# EAGLE schematic ComputeModule (EAGLE 9.4.2)
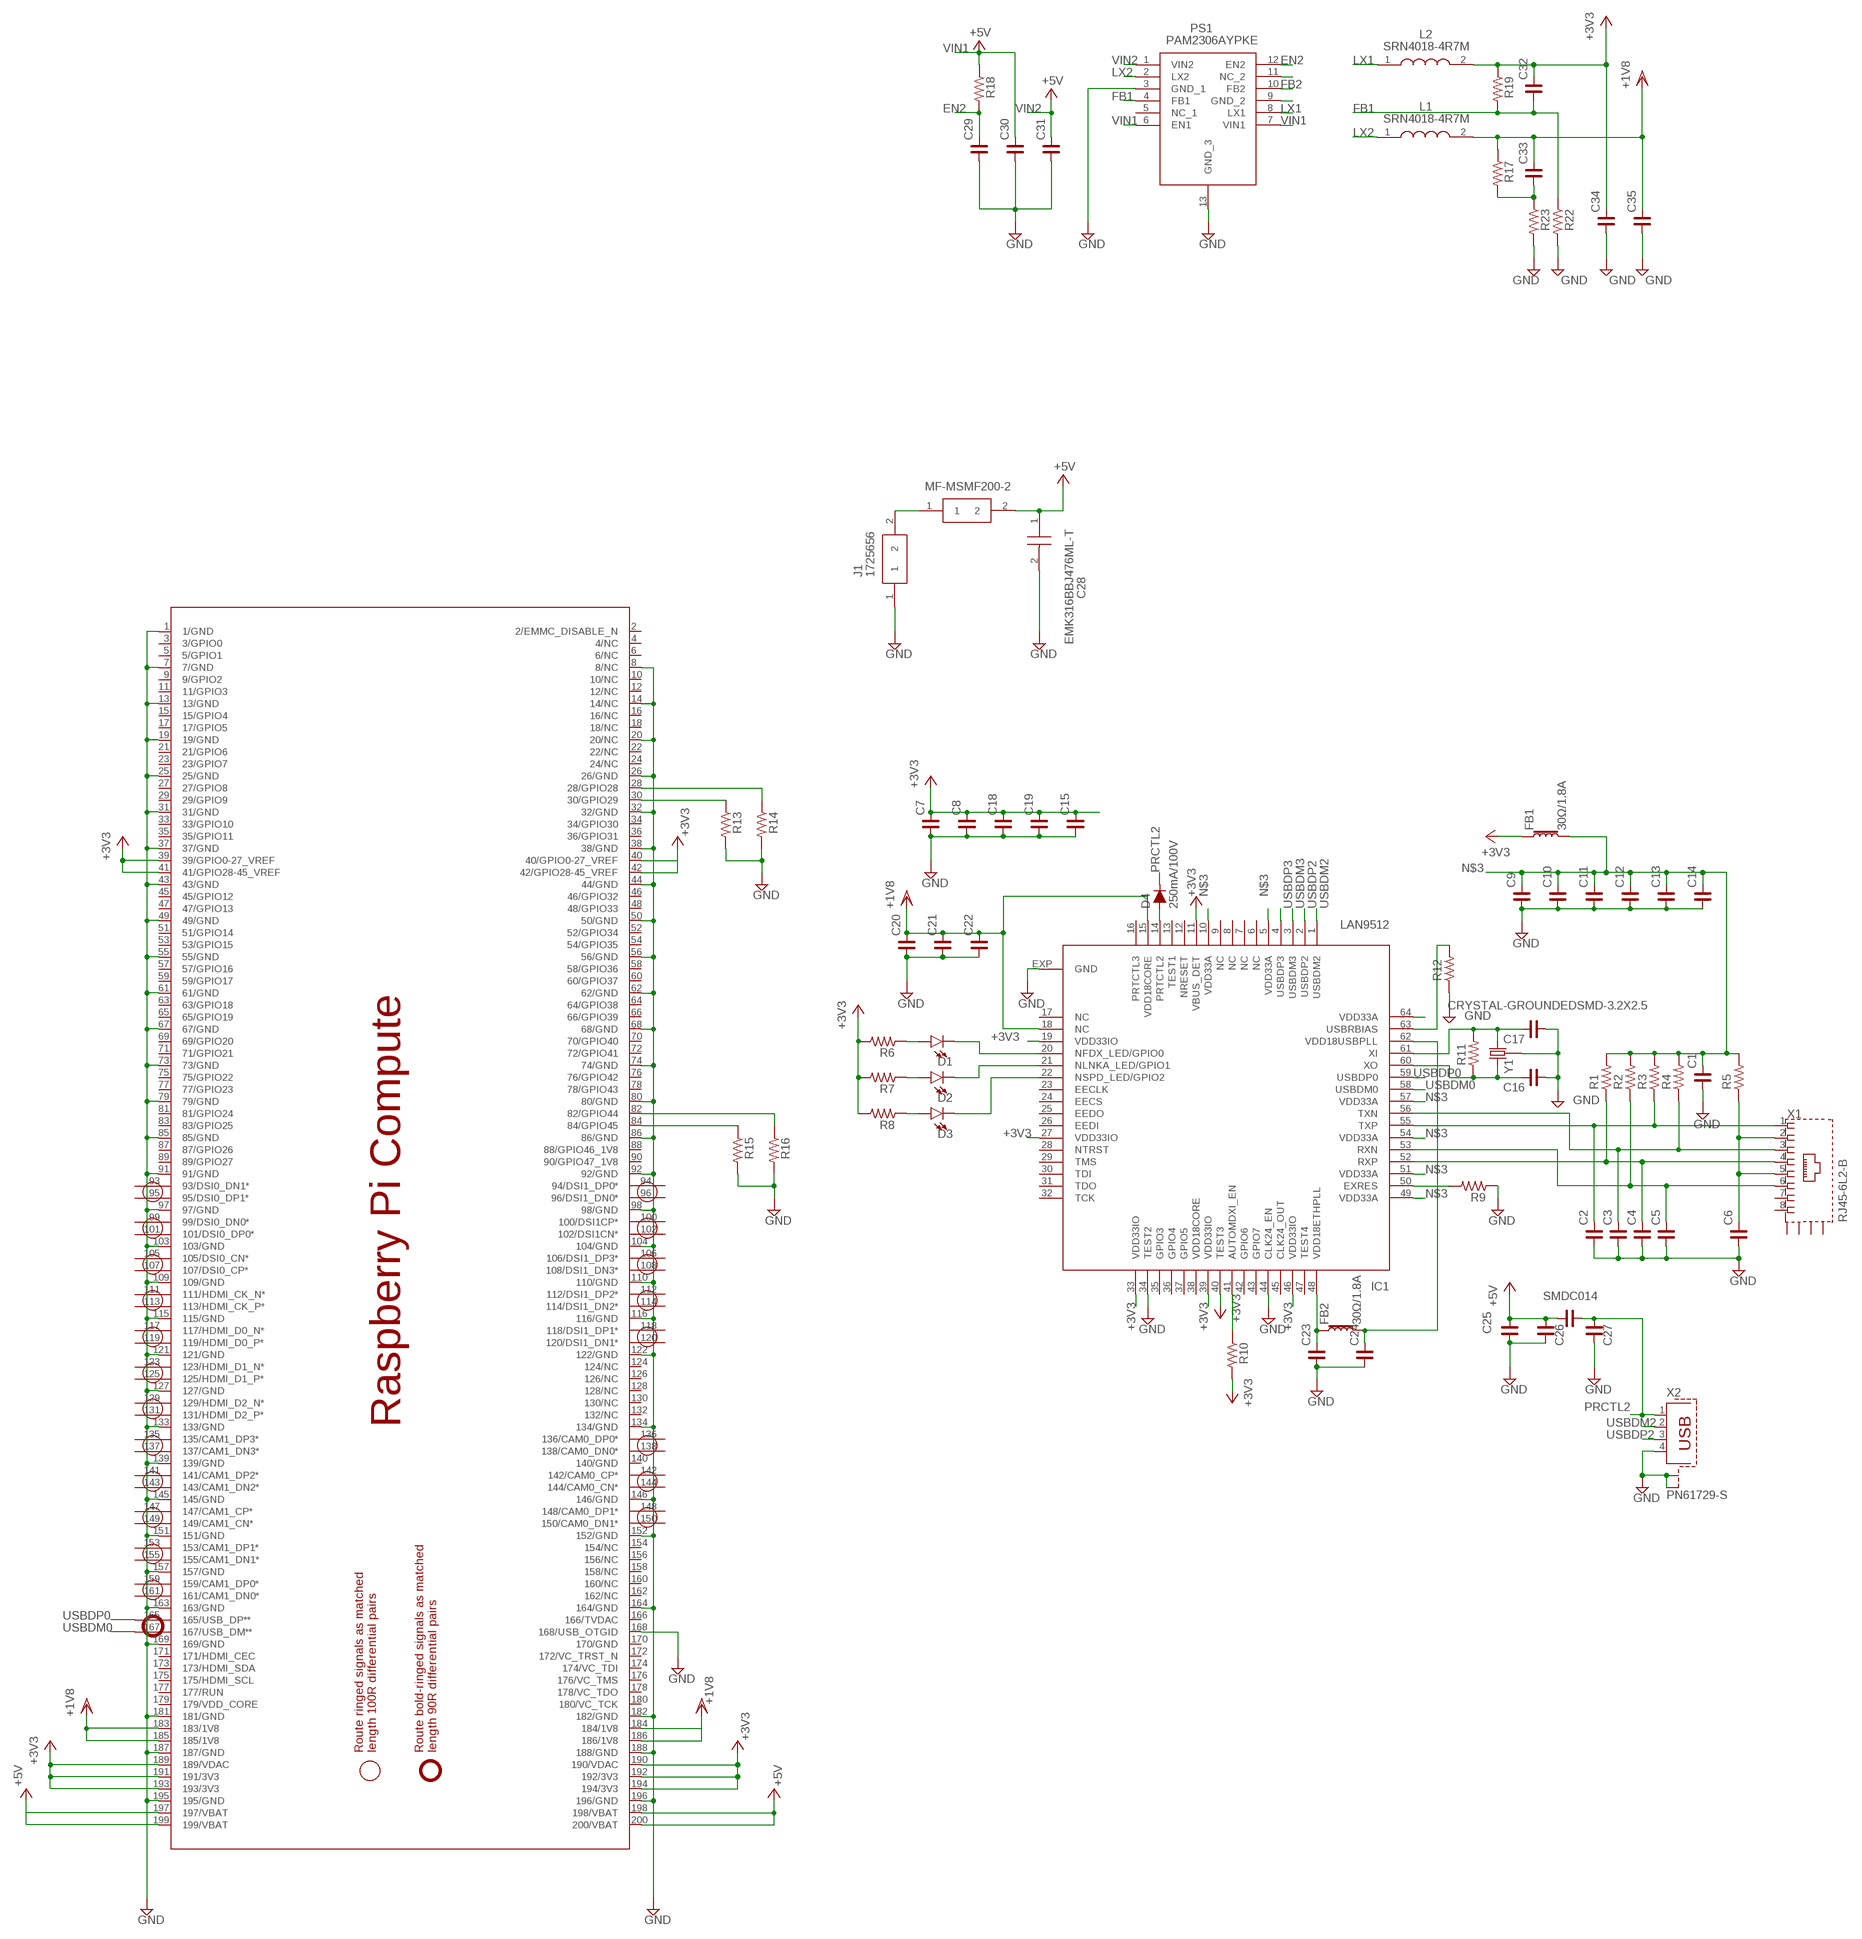
[diagram p0: schematic, sheet 1]

## Parts
C1  C_0603  [C0603]
C2  C_0603  [C0603]
C3  C_0603  [C0603]
C4  C_0603  [C0603]
C5  C_0603  [C0603]
C6  C_0603  [C0603]
C7  C_0603  [C0603]
C8  C_0603  [C0603]
C9  C_0603  [C0603]
C10  C_0603  [C0603]
C11  C_0603  [C0603]
C12  C_0603  [C0603]
C13  C_0603  [C0603]
C14  C_0603  [C0603]
C15  C_0603  [C0603]
C16  C_0603  [C0603]
C17  C_0603  [C0603]
C18  C_0603  [C0603]
C19  C_0603  [C0603]
C20  C_0603  [C0603]
C21  C_0603  [C0603]
C22  C_0603  [C0603]
C23  C_0603  [C0603]
C24  C_0603  [C0603]
C25  C_0603  [C0603]
C26  C_0603  [C0603]
C27  C_0603  [C0603]
C28  EMK316BBJ476ML-T  [CAPC3216X180N]
C29  C_0603  [C0603]
C30  C_0603  [C0603]
C31  C_0603  [C0603]
C32  C_0603  [C0603]
C33  C_0603  [C0603]
C34  C_0603  [C0603]
C35  C_0603  [C0603]
D1  LED-FKIT-1206  [FKIT-LED-1206]
D2  LED-FKIT-1206  [FKIT-LED-1206]
D3  LED-FKIT-1206  [FKIT-LED-1206]
D4  250mA/100V  DIODE-BAS16J  [SOD-323]
F1  MF-MSMF200-2  [FUSC4632X85N]
FB1  30Ω/1.8A  FERRITE_BEAD-0603  [0603]
FB2  30Ω/1.8A  FERRITE_BEAD-0603  [0603]
IC1  LAN9512  [QFN64-9X9]
J1  1725656  [1725656]
L1  SRN4018-4R7M  [SRN4018]
L2  SRN4018-4R7M  [SRN4018]
PCB1  RPI_COMPUTE  [RPI_COMPUTE]
PS1  PAM2306AYPKE  [SON45P300X300X80-13N]
R1  R_0603  [R0603]
R2  R_0603  [R0603]
R3  R_0603  [R0603]
R4  R_0603  [R0603]
R5  R_0603  [R0603]
R6  R_0603  [R0603]
R7  R_0603  [R0603]
R8  R_0603  [R0603]
R9  R_0603  [R0603]
R10  R_0603  [R0603]
R11  R_0603  [R0603]
R12  R_0603  [R0603]
R13  R_0603  [R0603]
R14  R_0603  [R0603]
R15  R_0603  [R0603]
R16  R_0603  [R0603]
R17  R_0603  [R0603]
R18  R_0603  [R0603]
R19  R_0603  [R0603]
R22  R_0603  [R0603]
R23  R_0603  [R0603]
SMDC014  C_1812  [C1812]
X1  RJ45-6L2-B  [RJ45-SHIELD2]
X2  PN61729-S  [PN61729-S]
Y1  CRYSTAL-GROUNDEDSMD-3.2X2.5  [CRYSTAL-SMD-3.2X2.5MM]

## Nets
+3V3: C7.2 C8.2 C15.2 C18.2 C19.2 C32.2 C34.2 FB1.1 IC1.11(VBUS_DET) IC1.19(VDD33IO) IC1.27(VDD33IO) IC1.33(VDD33IO) IC1.39(VDD33IO) IC1.40(TEST3) IC1.46(VDD33IO) L2.2 PCB1.39(39/GPIO0-27_VREF) PCB1.41(41/GPIO28-45_VREF) PCB1.42(42/GPIO28-45_VREF) PCB1.189(189/VDAC) PCB1.190(190/VDAC) PCB1.191(191/3V3) PCB1.192(192/3V3) PCB1.193(193/3V3) PCB1.194(194/3V3) R6.2 R7.2 R8.2 R10.2 R19.1
+5V: C25.2 C26.2 C28.1 F1.2 PCB1.198(198/VBAT) PCB1.199(199/VBAT) PCB1.200(200/VBAT) SMDC014.1
EN2: C29.2 PS1.12(EN2) R18.2
FB1: C32.1 PS1.4(FB1) R19.2 R22.1
FB2: PS1.10(FB2)
GND: C1.1 C2.1 C3.1 C4.1 C5.1 C6.1 C7.1 C8.1 C9.1 C10.1 C11.1 C12.1 C13.1 C14.1 C15.1 C16.1 C17.1 C18.1 C19.1 C20.1 C21.1 C22.1 C23.1 C24.1 C25.1 C26.1 C27.1 C28.2 C34.1 C35.1 IC1.34(TEST2) IC1.44(CLK24_EN) IC1.EXP(GND) J1.1 PCB1.1(1/GND) PCB1.7(7/GND) PCB1.8(8/NC) PCB1.13(13/GND) PCB1.14(14/NC) PCB1.19(19/GND) PCB1.20(20/NC) PCB1.25(25/GND) PCB1.26(26/GND) PCB1.31(31/GND) PCB1.32(32/GND) PCB1.37(37/GND) PCB1.38(38/GND) PCB1.43(43/GND) PCB1.44(44/GND) PCB1.49(49/GND) PCB1.50(50/GND) PCB1.55(55/GND) PCB1.56(56/GND) PCB1.61(61/GND) PCB1.62(62/GND) PCB1.67(67/GND) PCB1.68(68/GND) PCB1.73(73/GND) PCB1.74(74/GND) PCB1.79(79/GND) PCB1.80(80/GND) PCB1.85(85/GND) PCB1.86(86/GND) PCB1.91(91/GND) PCB1.92(92/GND) PCB1.97(97/GND) PCB1.98(98/GND) PCB1.103(103/GND) PCB1.104(104/GND) PCB1.109(109/GND) PCB1.110(110/GND) PCB1.115(115/GND) PCB1.116(116/GND) PCB1.121(121/GND) PCB1.122(122/GND) PCB1.127(127/GND) PCB1.133(133/GND) PCB1.134(134/GND) PCB1.139(139/GND) PCB1.145(145/GND) PCB1.146(146/GND) PCB1.151(151/GND) PCB1.152(152/GND) PCB1.157(157/GND) PCB1.163(163/GND) PCB1.164(164/GND) PCB1.168(168/USB_OTGID) PCB1.169(169/GND) PCB1.181(181/GND) PCB1.182(182/GND) PCB1.187(187/GND) PCB1.188(188/GND) PCB1.195(195/GND) PCB1.196(196/GND) PS1.3(GND_1) PS1.13(GND_3) R9.1 R12.1 R13.2 R14.2 R15.2 R16.2 R22.2 R23.2 X2.4 X2.S1 X2.S2 Y1.2 Y1.4
LX1: L2.1 PS1.8(LX1)
LX2: L1.1 PS1.2(LX2)
N$1: C6.2 R5.1 X1.2 X1.5
N$2: C2.2 IC1.55(TXP) R3.1 X1.1
N$3: C1.2 C9.2 C10.2 C11.2 C12.2 C13.2 C14.2 FB1.2 IC1.5(VDD33A) IC1.10(VDD33A) IC1.49(VDD33A) IC1.51(VDD33A) IC1.54(VDD33A) IC1.57(VDD33A) R1.2 R2.2 R3.2 R4.2 R5.2
N$4: C3.2 IC1.56(TXN) R4.1 X1.3
N$5: C4.2 IC1.52(RXP) R1.1 X1.4
N$6: C5.2 IC1.53(RXN) R2.1 X1.6
N$7: D1.C IC1.20(NFDX_LED/GPIO0)
N$8: D2.C IC1.21(NLNKA_LED/GPIO1)
N$9: D3.C IC1.22(NSPD_LED/GPIO2)
N$10: D1.A R6.1
N$11: IC1.64(VDD33A)
N$12: D2.A R7.1
N$13: D3.A R8.1
N$14: IC1.50(EXRES) R9.2
N$15: C16.2 IC1.60(XO) R11.1 Y1.1
N$16: IC1.41(AUTOMDXI_EN) R10.1
N$17: C17.2 IC1.61(XI) R11.2 Y1.3
N$18: C23.2 FB2.1 IC1.48(VDD18ETHPLL)
N$19: C24.2 FB2.2 IC1.62(VDD18USBPLL)
N$20: F1.1 J1.2
N$21: IC1.63(USBRBIAS) R12.2
N$22: D4.A IC1.14(PRTCTL2)
N$23: PCB1.28(28/GPIO28) R14.1
N$24: PCB1.30(30/GPIO29) R13.1
N$25: PCB1.40(40/GPIO0-27_VREF)
N$26: PCB1.82(82/GPIO44) R16.1
N$27: PCB1.84(84/GPIO45) R15.1
N$28: PCB1.184(184/1V8)
N$31: PS1.11(NC_2)
N$32: PCB1.197(197/VBAT)
N$33: C29.1 C30.1 C31.1 ; supply symbol labelled GND
N$34: PS1.9(GND_2)
N$35: C33.1 R17.2 R23.1
PRCTL2: C27.2 D4.C SMDC014.2 X2.1
USBDM0: IC1.58(USBDM0) PCB1.167(167/USB_DM**)
USBDM2: IC1.1(USBDM2) X2.2
USBDM3: IC1.3(USBDM3)
USBDP0: IC1.59(USBDP0) PCB1.165(165/USB_DP**)
USBDP2: IC1.2(USBDP2) X2.3
USBDP3: IC1.4(USBDP3)
VDD: C20.2 C21.2 C22.2 C33.2 C35.2 IC1.15(VDD18CORE) IC1.18(NC) L1.2 PCB1.183(183/1V8) PCB1.185(185/1V8) PCB1.186(186/1V8) R17.1 ; supply symbol labelled +1V8
VIN1: C30.2 PS1.6(EN1) PS1.7(VIN1) R18.1 ; supply symbol labelled +5V
VIN2: C31.2 PS1.1(VIN2) ; supply symbol labelled +5V
Unconnected: IC1.6(NC) IC1.7(NC) IC1.8(NC) IC1.9(NC) IC1.12(NRESET) IC1.13(TEST1) IC1.16(PRTCTL3) IC1.17(NC) IC1.23(EECLK) IC1.24(EECS) IC1.25(EEDO) IC1.26(EEDI) IC1.28(NTRST) IC1.29(TMS) IC1.30(TDI) IC1.31(TDO) IC1.32(TCK) IC1.35(GPIO3) IC1.36(GPIO4) IC1.37(GPIO5) IC1.38(VDD18CORE) IC1.42(GPIO6) IC1.43(GPIO7) IC1.45(CLK24_OUT) IC1.47(TEST4) PCB1.2(2/EMMC_DISABLE_N) PCB1.3(3/GPIO0) PCB1.4(4/NC) PCB1.5(5/GPIO1) PCB1.6(6/NC) PCB1.9(9/GPIO2) PCB1.10(10/NC) PCB1.11(11/GPIO3) PCB1.12(12/NC) PCB1.15(15/GPIO4) PCB1.16(16/NC) PCB1.17(17/GPIO5) PCB1.18(18/NC) PCB1.21(21/GPIO6) PCB1.22(22/NC) PCB1.23(23/GPIO7) PCB1.24(24/NC) PCB1.27(27/GPIO8) PCB1.29(29/GPIO9) PCB1.33(33/GPIO10) PCB1.34(34/GPIO30) PCB1.35(35/GPIO11) PCB1.36(36/GPIO31) PCB1.45(45/GPIO12) PCB1.46(46/GPIO32) PCB1.47(47/GPIO13) PCB1.48(48/GPIO33) PCB1.51(51/GPIO14) PCB1.52(52/GPIO34) PCB1.53(53/GPIO15) PCB1.54(54/GPIO35) PCB1.57(57/GPIO16) PCB1.58(58/GPIO36) PCB1.59(59/GPIO17) PCB1.60(60/GPIO37) PCB1.63(63/GPIO18) PCB1.64(64/GPIO38) PCB1.65(65/GPIO19) PCB1.66(66/GPIO39) PCB1.69(69/GPIO20) PCB1.70(70/GPIO40) PCB1.71(71/GPIO21) PCB1.72(72/GPIO41) PCB1.75(75/GPIO22) PCB1.76(76/GPIO42) PCB1.77(77/GPIO23) PCB1.78(78/GPIO43) PCB1.81(81/GPIO24) PCB1.83(83/GPIO25) PCB1.87(87/GPIO26) PCB1.88(88/GPIO46_1V8) PCB1.89(89/GPIO27) PCB1.90(90/GPIO47_1V8) PCB1.93(93/DSI0_DN1*) PCB1.94(94/DSI1_DP0*) PCB1.95(95/DSI0_DP1*) PCB1.96(96/DSI1_DN0*) PCB1.99(99/DSI0_DN0*) PCB1.100(100/DSI1CP*) PCB1.101(101/DSI0_DP0*) PCB1.102(102/DSI1CN*) PCB1.105(105/DSI0_CN*) PCB1.106(106/DSI1_DP3*) PCB1.107(107/DSI0_CP*) PCB1.108(108/DSI1_DN3*) PCB1.111(111/HDMI_CK_N*) PCB1.112(112/DSI1_DP2*) PCB1.113(113/HDMI_CK_P*) PCB1.114(114/DSI1_DN2*) PCB1.117(117/HDMI_D0_N*) PCB1.118(118/DSI1_DP1*) PCB1.119(119/HDMI_D0_P*) PCB1.120(120/DSI1_DN1*) PCB1.123(123/HDMI_D1_N*) PCB1.124(124/NC) PCB1.125(125/HDMI_D1_P*) PCB1.126(126/NC) PCB1.128(128/NC) PCB1.129(129/HDMI_D2_N*) PCB1.130(130/NC) PCB1.131(131/HDMI_D2_P*) PCB1.132(132/NC) PCB1.135(135/CAM1_DP3*) PCB1.136(136/CAM0_DP0*) PCB1.137(137/CAM1_DN3*) PCB1.138(138/CAM0_DN0*) PCB1.140(140/GND) PCB1.141(141/CAM1_DP2*) PCB1.142(142/CAM0_CP*) PCB1.143(143/CAM1_DN2*) PCB1.144(144/CAM0_CN*) PCB1.147(147/CAM1_CP*) PCB1.148(148/CAM0_DP1*) PCB1.149(149/CAM1_CN*) PCB1.150(150/CAM0_DN1*) PCB1.153(153/CAM1_DP1*) PCB1.154(154/NC) PCB1.155(155/CAM1_DN1*) PCB1.156(156/NC) PCB1.158(158/NC) PCB1.159(159/CAM1_DP0*) PCB1.160(160/NC) PCB1.161(161/CAM1_DN0*) PCB1.162(162/NC) PCB1.166(166/TVDAC) PCB1.170(170/GND) PCB1.171(171/HDMI_CEC) PCB1.172(172/VC_TRST_N) PCB1.173(173/HDMI_SDA) PCB1.174(174/VC_TDI) PCB1.175(175/HDMI_SCL) PCB1.176(176/VC_TMS) PCB1.177(177/RUN) PCB1.178(178/VC_TDO) PCB1.179(179/VDD_CORE) PCB1.180(180/VC_TCK) PS1.5(NC_1) X1.7 X1.8 X1.S1(S) X1.S2(S) X1.S3(S) X1.S4(S)

## Library data of the parts
C1-C27 C29-C35 SMDC014 = rc-master-smd:C_: NON-POLARIZED CAP
C28 = SamacSys_Parts:EMK316BBJ476ML-T: Taiyo Yuden EMK316BBJ476ML-T 47F MLCC 16V dc +/-20% Tolerance SMD Source: Datasheet <https://componentsearchengine.com/Datasheets/1/EMK316BBJ476ML-T.pdf>; DESCRIPTION: Taiyo Yuden EMK316BBJ476ML-T 47F MLCC 16V dc +/-20% Tolerance SMD; HEIGHT: 1.8mm; MANUFACTURER_NAME: TAIYO YUDEN; MANUFACTURER_PART_NUMBER: EMK316BBJ476ML-T; MOUSER_PART_NUMBER: 963-EMK316BBJ476ML-T; MOUSER_PRICE-STOCK: https://www.mouser.com/Search/Refine.aspx?Keyword=963-EMK316BBJ476ML-T
D1-D3 = SparkFun-LED:LED: LED (Generic) Standard schematic elements and footprints for 5mm, 3mm, 1206, and 0603 sized LEDs. Generic LEDs with no color specified.
D4 = SparkFun-DiscreteSemi:DIODE: Diode These are standard reverse protection diodes and small signal diodes. SparkFun Products: SparkFun SparkPunk Sound Kit <https://www.sparkfun.com/products/11177> SparkFun ESP8266 Thing <https://www.sparkfun.com/products/13231>; PROD_ID: DIO-09646
F1 = SamacSys_Parts:MF-MSMF200-2: Fuse, PTC, Resettable, SMD, 1812, 2.0A Bourns 2A Surface Mount Resettable Fuse, 8 V Source: Datasheet <https://componentsearchengine.com/Datasheets/1/MF-MSMF200-2.pdf>; DESCRIPTION: Fuse, PTC, Resettable, SMD, 1812, 2.0A Bourns 2A Surface Mount Resettable Fuse, 8 V; HEIGHT: 0.85mm; MANUFACTURER_NAME: Bourns; MANUFACTURER_PART_NUMBER: MF-MSMF200-2; MOUSER_PART_NUMBER: 652-MF-MSMF200-2; MOUSER_PRICE-STOCK: https://www.mouser.com/Search/Refine.aspx?Keyword=652-MF-MSMF200-2
FB1 FB2 = SparkFun-Coils:FERRITE_BEAD: Ferrite Bead (blocks, cores, rings, chokes, etc.) Inductor with layers of ferrite used to suppress high frequencies. Often used to isolate high frequency noise. SparkFun Products: IOIO-OTG - V2.2 <https://www.sparkfun.com/products/13613> SparkFun SAMD21 Mini Breakout <https://www.sparkfun.com/products/13664> SparkFun 6 Degrees of Freedom Breakout - LSM6DS3 <https://www.sparkfun.com/products/13339> SparkFun SAMD21 Dev Breakout <https://www.sparkfun.com/products/13672>; PROD_ID: NDUC-07859
IC1 = raspberrypi_cm:LAN9512: LAN9512 www.hasseb.fi
J1 = SamacSys_Parts:1725656: 2 way PCB vertical mount terminal,2.54mm 2 way PCB vertical mount terminal,2.54mm Source: Datasheet <https://componentsearchengine.com/Datasheets/1/1725656.pdf>; DESCRIPTION: 2 way PCB vertical mount terminal,2.54mm 2 way PCB vertical mount terminal,2.54mm; HEIGHT: 8mm; MANUFACTURER_NAME: Phoenix Contact; MANUFACTURER_PART_NUMBER: 1725656; MOUSER_PART_NUMBER: 651-1725656; MOUSER_PRICE-STOCK: https://www.mouser.com/Search/Refine.aspx?Keyword=651-1725656
L1 L2 = SamacSys_Parts:SRN4018-4R7M: Inductor SMD 4x4 semi-shielded 4,7uH Bourns SRN4018 Series Shielded Wire-wound SMD Inductor with a Ferrite Core, 4.7 uH +/-20% Wire-Wound 1.9A rms Idc Source: Datasheet <https://componentsearchengine.com/Datasheets/1/SRN4018-4R7M.pdf>; DESCRIPTION: Inductor SMD 4x4 semi-shielded 4,7uH Bourns SRN4018 Series Shielded Wire-wound SMD Inductor with a Ferrite Core, 4.7 uH +/-20% Wire-Wound 1.9A rms Idc; HEIGHT: mm; MANUFACTURER_NAME: Bourns; MANUFACTURER_PART_NUMBER: SRN4018-4R7M; MOUSER_PART_NUMBER: 652-SRN4018-4R7M; MOUSER_PRICE-STOCK: https://www.mouser.com/Search/Refine.aspx?Keyword=652-SRN4018-4R7M
PCB1 = e14_Rpi_Compute_RevC:RPI_COMPUTE: Device for a Raspberry PI Compute module. Note that the package is for a DDR2 connector of 'standard' orientation. Example: TE Connectivity P/N: 1565917-4, Newark P/N: 08P0616, Farnell P/N: 2112525 More information is available at http://www.element14.com/community/community/raspberry-pi/raspberry-pi-compute-module
PS1 = SamacSys_Parts:PAM2306AYPKE: DUAL PWM ST-DOWN DC-DC CONVerter DiodesZetex PAM2306AYPKE, Dual Step Down DC-DC Converter, 1A, Maximum of 3.3 V, 12-Pin WDFN Source: Datasheet <https://componentsearchengine.com/Datasheets/1/PAM2306AYPKE.pdf>; DESCRIPTION: DUAL PWM ST-DOWN DC-DC CONVerter DiodesZetex PAM2306AYPKE, Dual Step Down DC-DC Converter, 1A, Maximum of 3.3 V, 12-Pin WDFN; HEIGHT: 0.8mm; MANUFACTURER_NAME: Diodes Inc.; MANUFACTURER_PART_NUMBER: PAM2306AYPKE; MOUSER_PART_NUMBER: 621-PAM2306AYPKE; MOUSER_PRICE-STOCK: https://www.mouser.com/Search/Refine.aspx?Keyword=621-PAM2306AYPKE
R1-R19 R22 R23 = rc-master-smd:R_: RESISTOR
X1 = con-tycoelectronics:RJ45*2: RJ45 Low Profile Shield Type 2 For all RJ45 L, LC, LCT and X Series Models Source: www.tycoelectronics.com .. ENG_DS_1654001_1099_RJ_L_0507.pdf; MPN: RJ45-6L2-B; OC_FARNELL: unknown; OC_NEWARK: 16R6096
X2 = con-berg:PN61729-S: BERG USB connector; OC_FARNELL: unknown; OC_NEWARK: unknown
Y1 = SparkFun-Clocks:CRYSTAL-GROUNDED: Crystals w/ Ground Pin (Generic) These are passive quartz crystals, which can be used as a clock source for a microcontroller. Crystal's are usually two-terminal devices. A third terminal may be optionally connected to ground, as recommended by the manufaturer.